# EAGLE design sens (EAGLE 6.3)
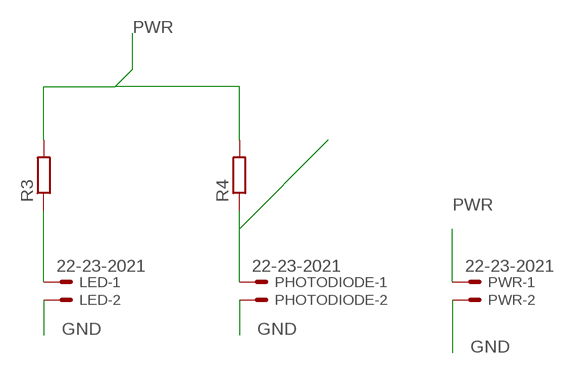
[diagram p0: schematic, sheet 1]

## Parts
LED  22-23-2021  [22-23-2021]
PHOTODIODE  22-23-2021  [22-23-2021]
PWR  22-23-2021  [22-23-2021]
R3  R-EU_0207/7  [0207/7]
R4  R-EU_0207/7  [0207/7]

## Nets
GND: LED.2 PHOTODIODE.2 PWR.2
N$1: LED.1 R3.1
N$3: PHOTODIODE.1 R4.1
PWR: PWR.1 R3.2 R4.2

## Library data of the parts
LED PHOTODIODE PWR = con-molex:22-23-2021: .100" (2.54mm) Center Header - 2 Pin; MF: MOLEX; MPN: 22-23-2021; OC_FARNELL: 1462926; OC_NEWARK: 25C3832
R3 R4 = resistor:R-EU_: RESISTOR, European symbol

## Board
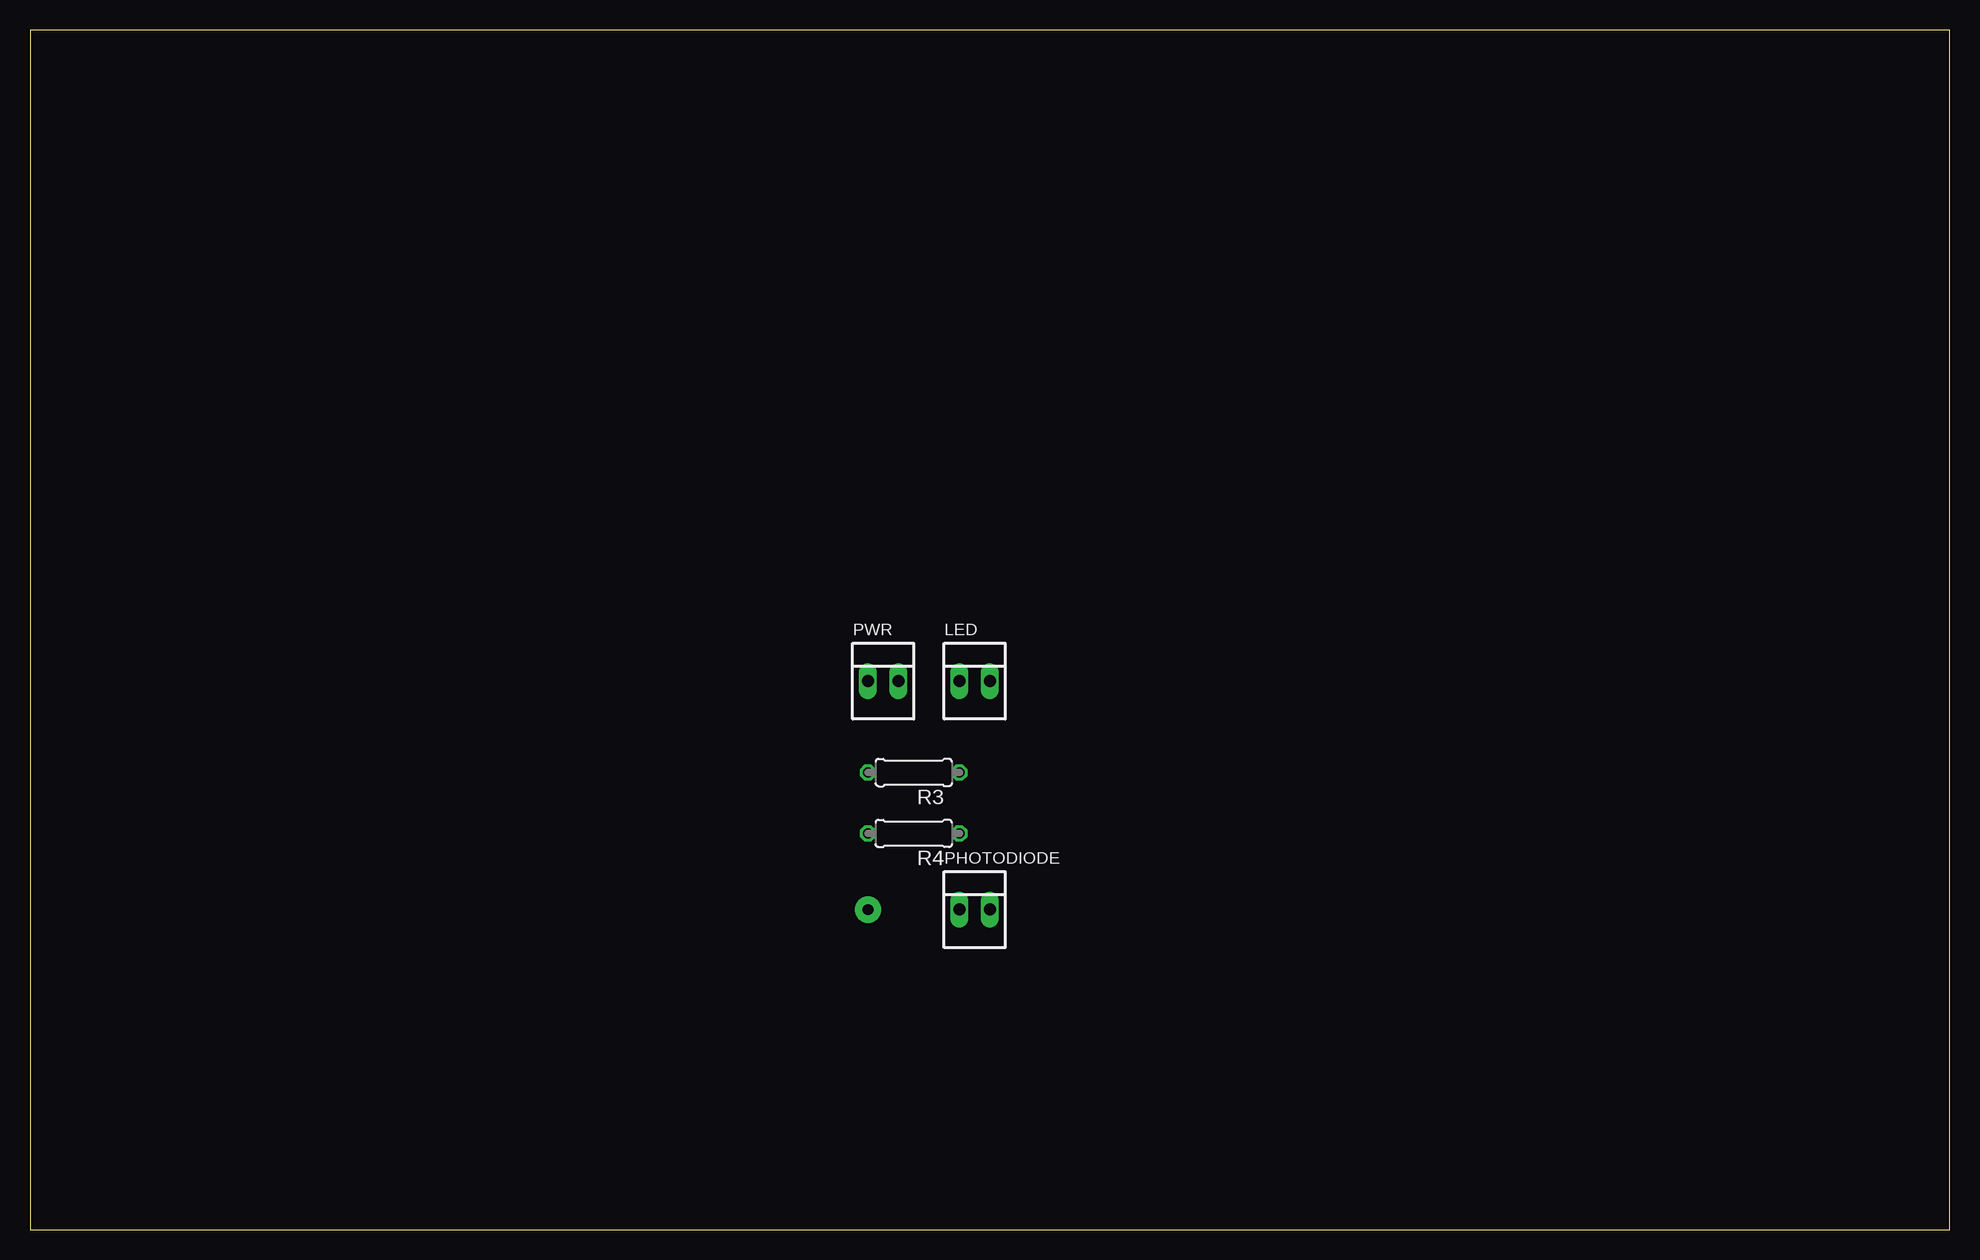
[diagram p1: board, top side]
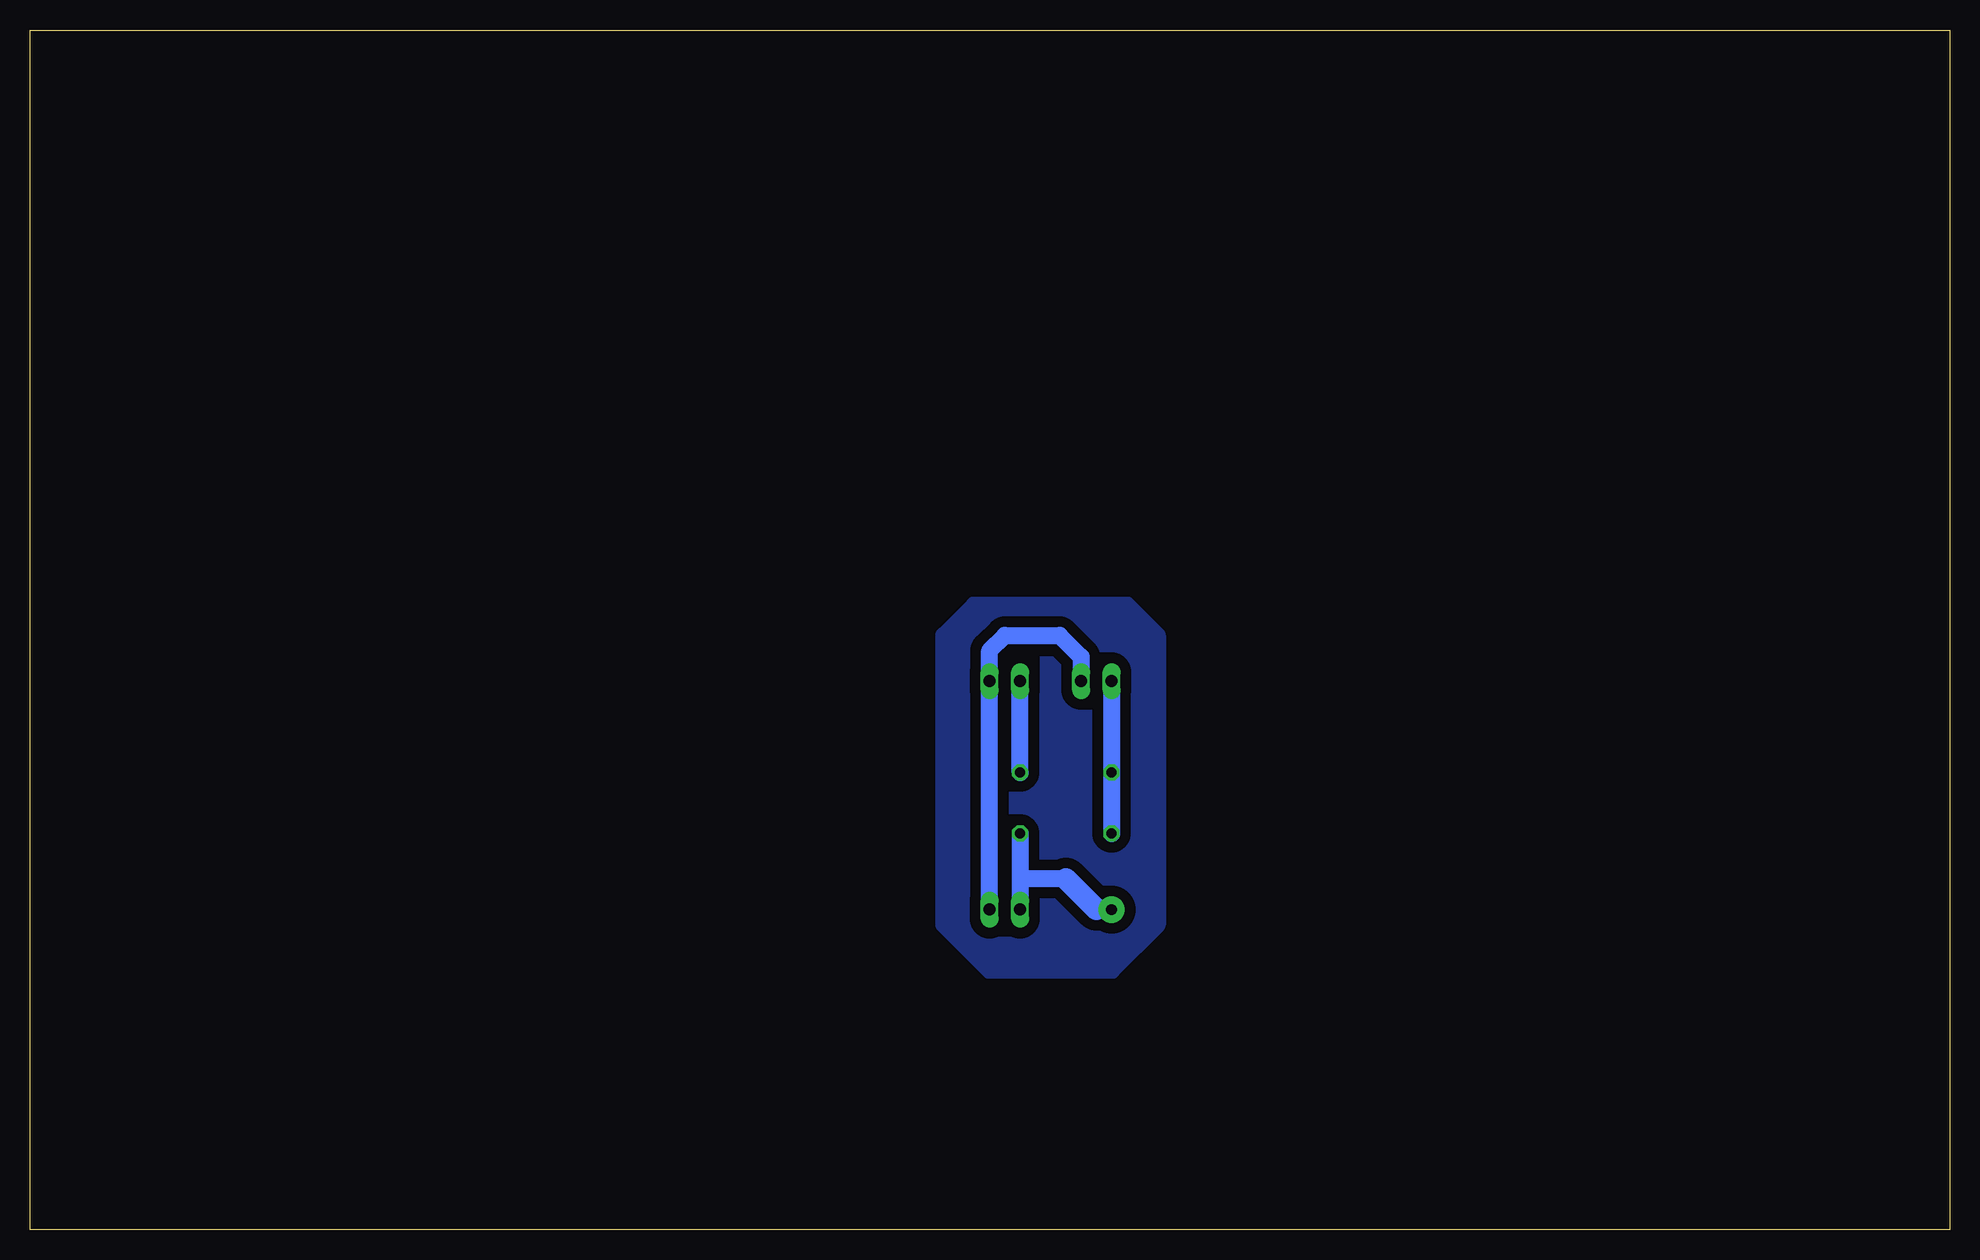
[diagram p2: board, bottom side, seen from below]

Size 160 x 100 mm. Coordinates in mm from the lower left corner, seen from the top.
Outline: 0,0 160,0 160,100 0,100 0,0
Copper layers (1*16): Top 0.035mm / dielectric 1.5mm / Bottom 0.035mm
Design rules "default *": minimum track width 10mil, minimum drill 24mil, track to track 35mil, track to pad 35mil, pad to pad 8mil, via to via 8mil, smd to smd 8mil, copper to edge 40mil, drill to drill 8mil, minimum pad ring 10mil, minimum via ring 8mil, stop-mask expansion 4mil, vias tented up to drill 0mil, thermal gap 10mil

### Footprints (pad centres in the part's own frame; a part is rotated, then mirrored left to right if it is on the bottom)
22-23-2021 = drill 1 long: 1 -1.27,0; 2 1.27,0
0207/7 = drill 0.813 octagon: 1 -3.81,0; 2 3.81,0

### Placement (x,y rotation side)
LED  78.74,45.72 0 top
PHOTODIODE  78.74,26.67 0 top
PWR  71.12,45.72 0 top
R3  73.66,38.1 180 top
R4  73.66,33.02 180 top

### Tracks (layer width: path | path; a pad name or v marks a point on that pad's centre or on a via)
GND
  Bottom 1.422: PHOTODIODE.2 LED.2 80.01,48.26 78.74,49.53 74.19,49.53 72.39,47.73 PWR.2
N$1
  Bottom 1.422: R3.1 LED.1
N$2
  pour Bottom: 66.04,36.83 66.04,25.4 69.85,21.59 80.01,21.59 83.82,25.4 83.82,49.53 81.28,52.07 68.58,52.07 66.04,49.53
N$3  (via drill 0.9 pad 2.18)
  Bottom 1.422: v69.85,26.67 71.12,26.67 | R4.1 77.47,29.21 | 77.47,29.21 PHOTODIODE.1 | 73.66,29.21 77.47,29.21
  Bottom 1.778: 71.12,26.67 73.66,29.21
PWR
  Bottom 1.422: PWR.1 R3.2 R4.2